# Altium schematic sheet controller.SchDoc
size A4; SheetNumber: 1; SheetTotal: 2
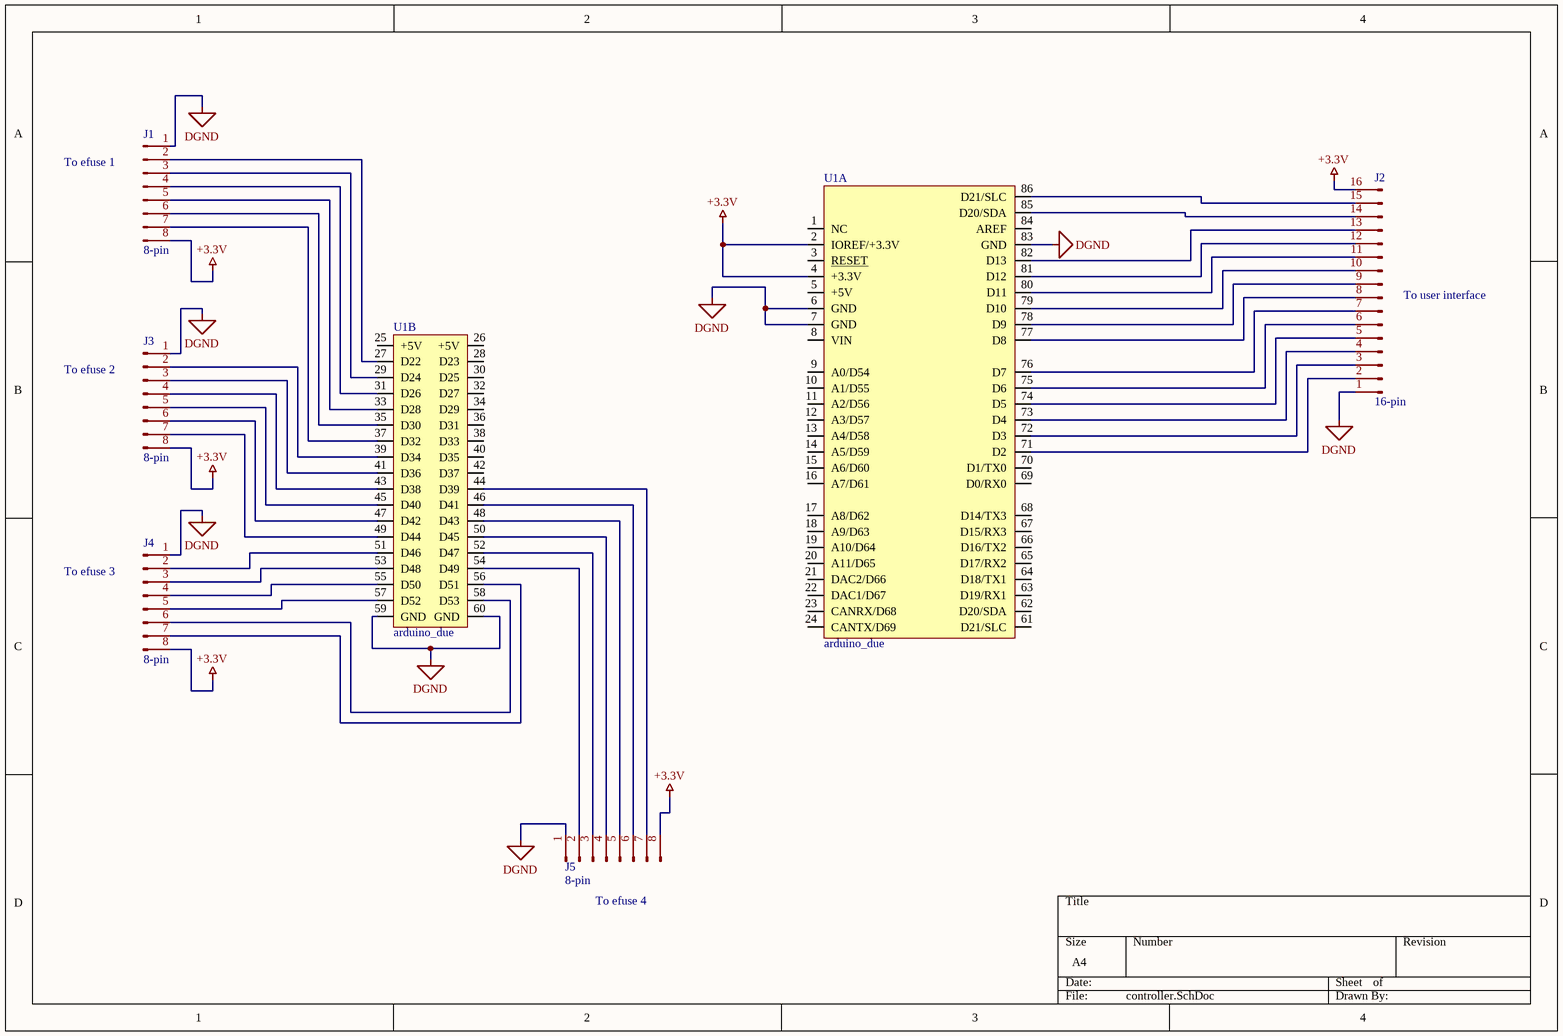
[diagram p0: controller.SchDoc]

## Parts
J1  8-pin  [JST_XH_B8B-XH-A_1x08_P2.50mm_Vertical]
J2  16-pin  [JST_XH_B16B-XH-A_1x16_P2.50mm_Vertical]
J3  8-pin  [JST_XH_B8B-XH-A_1x08_P2.50mm_Vertical]
J4  8-pin  [JST_XH_B8B-XH-A_1x08_P2.50mm_Vertical]
J5  8-pin  [JST_XH_B8B-XH-A_1x08_P2.50mm_Vertical]
U1  arduino_due  [ARDUINO_DUE]  (parts A,B of 2)

## Nets
+3.3V: J1.8(Pin_8) J2.16(Pin_16) J3.8(Pin_8) J4.8(Pin_8) J5.8(Pin_8) U1.2(IOREF/+3.3V) U1.4(+3.3V)
DGND: J1.1(Pin_1) J2.1(Pin_1) J3.1(Pin_1) J4.1(Pin_1) J5.1(Pin_1) U1.6(GND) U1.7(GND) U1.59(GND) U1.60(GND) U1.83(GND)
NetJ1_2: J1.2(Pin_2) U1.27(D22)
NetJ1_3: J1.3(Pin_3) U1.29(D24)
NetJ1_4: J1.4(Pin_4) U1.31(D26)
NetJ1_5: J1.5(Pin_5) U1.33(D28)
NetJ1_6: J1.6(Pin_6) U1.35(D30)
NetJ1_7: J1.7(Pin_7) U1.37(D32)
NetJ2_2: J2.2(Pin_2) U1.71(D2)
NetJ2_3: J2.3(Pin_3) U1.72(D3)
NetJ2_4: J2.4(Pin_4) U1.73(D4)
NetJ2_5: J2.5(Pin_5) U1.74(D5)
NetJ2_6: J2.6(Pin_6) U1.75(D6)
NetJ2_7: J2.7(Pin_7) U1.76(D7)
NetJ2_8: J2.8(Pin_8) U1.77(D8)
NetJ2_9: J2.9(Pin_9) U1.78(D9)
NetJ2_10: J2.10(Pin_10) U1.79(D10)
NetJ2_11: J2.11(Pin_11) U1.80(D11)
NetJ2_12: J2.12(Pin_12) U1.81(D12)
NetJ2_13: J2.13(Pin_13) U1.82(D13)
NetJ2_14: J2.14(Pin_14) U1.85(D20/SDA)
NetJ2_15: J2.15(Pin_15) U1.86(D21/SLC)
NetJ3_2: J3.2(Pin_2) U1.39(D34)
NetJ3_3: J3.3(Pin_3) U1.41(D36)
NetJ3_4: J3.4(Pin_4) U1.43(D38)
NetJ3_5: J3.5(Pin_5) U1.45(D40)
NetJ3_6: J3.6(Pin_6) U1.47(D42)
NetJ3_7: J3.7(Pin_7) U1.49(D44)
NetJ4_2: J4.2(Pin_2) U1.51(D46)
NetJ4_3: J4.3(Pin_3) U1.53(D48)
NetJ4_4: J4.4(Pin_4) U1.55(D50)
NetJ4_5: J4.5(Pin_5) U1.57(D52)
NetJ4_6: J4.6(Pin_6) U1.58(D53)
NetJ4_7: J4.7(Pin_7) U1.56(D51)
NetJ5_2: J5.2(Pin_2) U1.54(D49)
NetJ5_3: J5.3(Pin_3) U1.52(D47)
NetJ5_4: J5.4(Pin_4) U1.50(D45)
NetJ5_5: J5.5(Pin_5) U1.48(D43)
NetJ5_6: J5.6(Pin_6) U1.46(D41)
NetJ5_7: J5.7(Pin_7) U1.44(D39)

Not connected (* = marked no-connect by the designer): U1 1(NC) 3(RESET) 5(+5V) 8(VIN) 9(A0/D54) 10(A1/D55) 11(A2/D56) 12(A3/D57) 13(A4/D58) 14(A5/D59) 15(A6/D60) 16(A7/D61) 17(A8/D62) 18(A9/D63) 19(A10/D64) 20(A11/D65) 21(DAC2/D66) 22(DAC1/D67) 23(CANRX/D68) 24(CANTX/D69) 25(+5V) 26(+5V) 28(D23) 30(D25) 32(D27) 34(D29) 36(D31) 38(D33) 40(D35) 42(D37) 61(D21/SLC) 62(D20/SDA) 63(D19/RX1) 64(D18/TX1) 65(D17/RX2) 66(D16/TX2) 67(D15/RX3) 68(D14/TX3) 69(D0/RX0) 70(D1/TX0) 84(AREF)

## Notes on the sheet
- (near J1) To efuse 1
- (near J2) To user interface
- (near J3) To efuse 2
- (near J4) To efuse 3
- (near J5) To efuse 4